# Altium schematic sheet MAIN.SchDoc
size A
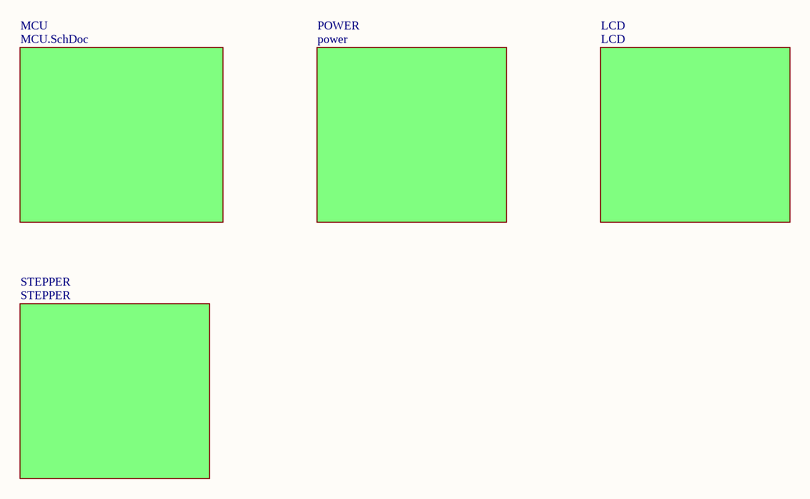
[diagram p0: MAIN.SchDoc]

## Sub-sheets
LCD = LCD: no entries
MCU = MCU.SchDoc: no entries
POWER = power: no entries
STEPPER = STEPPER: no entries